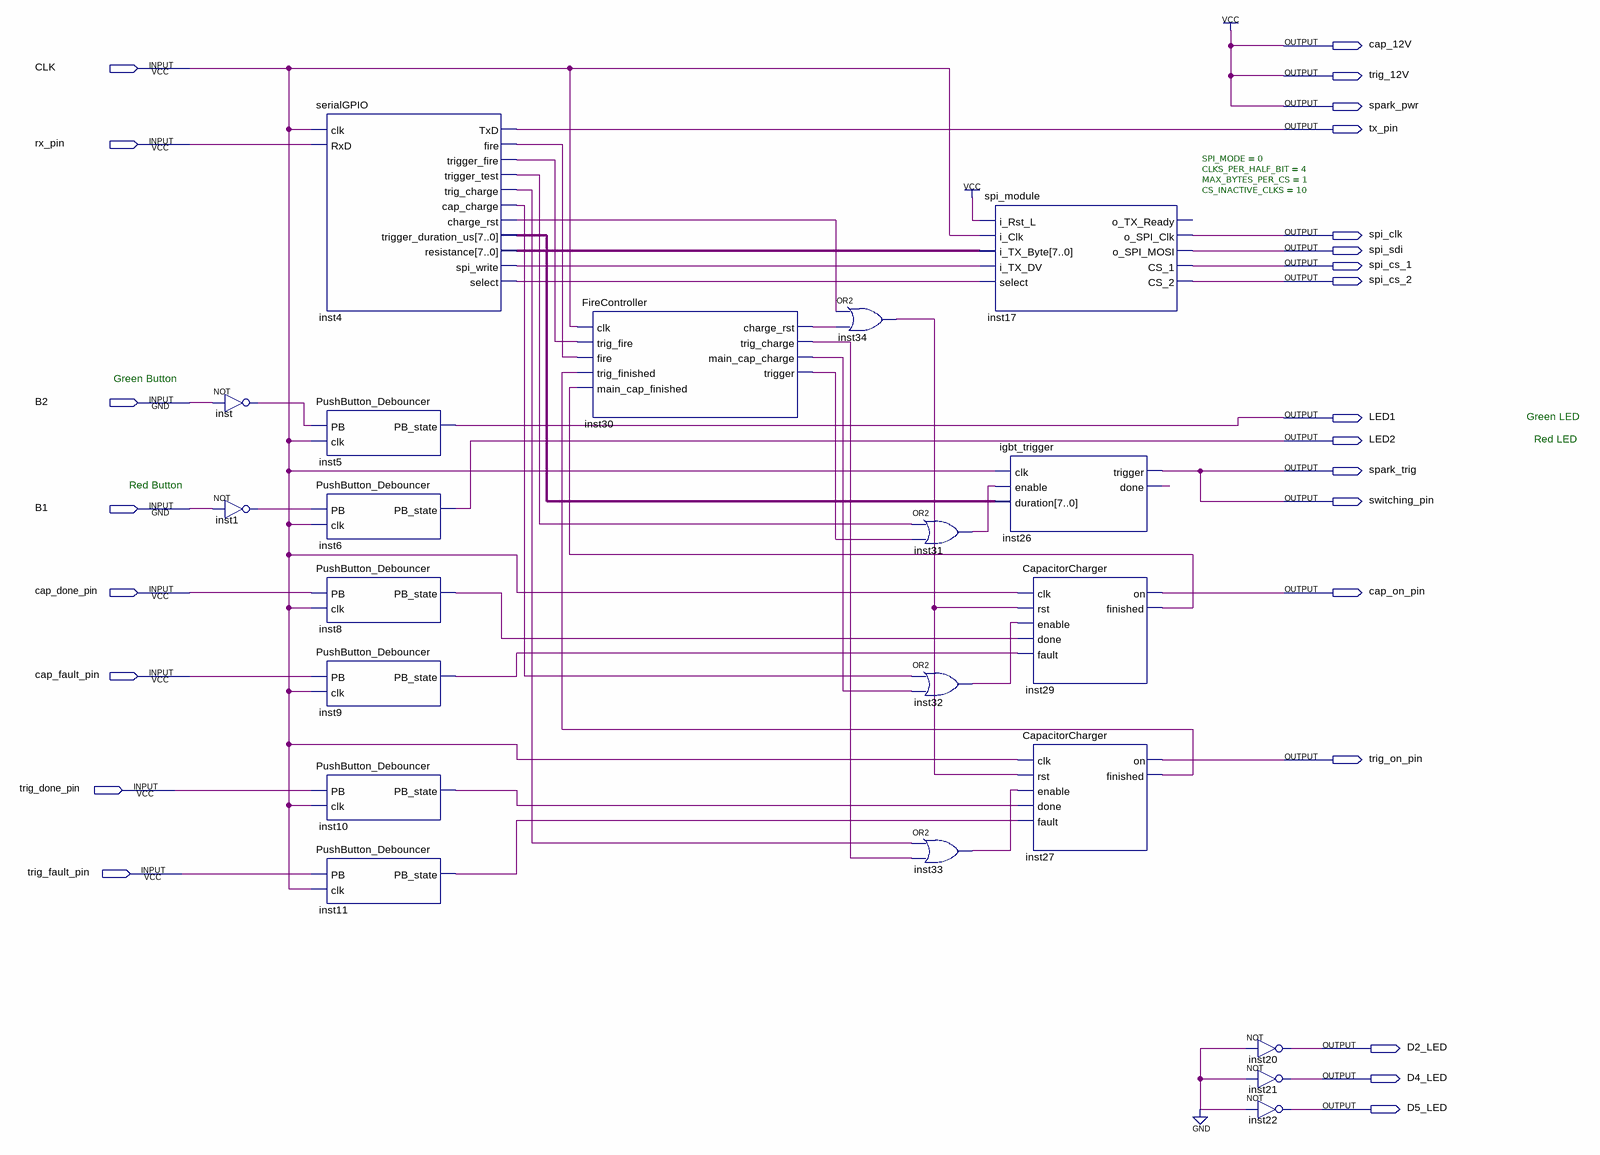
[diagram p0: schematic sheet]
// Quartus schematic PPT_FPGA_CYC_4.bdf as structural Verilog: 21 symbols, 25 pins
module PPT_FPGA_CYC_4 (
  input  CLK,
  input  rx_pin,
  input  B2,
  input  B1,
  input  cap_done_pin,
  input  cap_fault_pin,
  input  trig_done_pin,
  input  trig_fault_pin,
  output cap_12V,
  output trig_12V,
  output spark_pwr,
  output tx_pin,
  output spi_clk,
  output spi_sdi,
  output spi_cs_1,
  output spi_cs_2,
  output LED1,
  output LED2,
  output spark_trig,
  output switching_pin,
  output cap_on_pin,
  output trig_on_pin,
  output D2_LED,
  output D4_LED,
  output D5_LED
);

  wire inst1_out, inst4_cap_charge, inst4_charge_rst, inst4_fire, inst4_select, inst4_spi_write,
       inst4_trig_charge, inst4_trigger_fire, inst4_trigger_test, inst8_pb_state, inst9_pb_state,
       inst10_pb_state, inst11_pb_state, inst26_done, inst27_finished, inst29_finished, inst30_charge_rst,
       inst30_main_cap_charge, inst30_trig_charge, inst30_trigger, inst31_out, inst32_out, inst33_out,
       inst34_out, inst_out;
  wire [7:0] inst4_resistance, inst4_trigger_duration_us;

  not inst (inst_out, B2);
  not inst1 (inst1_out, B1);
  serialGPIO inst4 (
    .clk(CLK), .RxD(rx_pin), .TxD(tx_pin), .fire(inst4_fire), .trigger_fire(inst4_trigger_fire),
    .trigger_test(inst4_trigger_test), .trig_charge(inst4_trig_charge), .cap_charge(inst4_cap_charge),
    .charge_rst(inst4_charge_rst), .trigger_duration_us(inst4_trigger_duration_us),
    .resistance(inst4_resistance), .spi_write(inst4_spi_write), .select(inst4_select));
  PushButton_Debouncer inst5 (.PB(inst_out), .clk(CLK), .PB_state(LED1));
  PushButton_Debouncer inst6 (.PB(inst1_out), .clk(CLK), .PB_state(LED2));
  PushButton_Debouncer inst8 (.PB(cap_done_pin), .clk(CLK), .PB_state(inst8_pb_state));
  PushButton_Debouncer inst9 (.PB(cap_fault_pin), .clk(CLK), .PB_state(inst9_pb_state));
  PushButton_Debouncer inst10 (.PB(trig_done_pin), .clk(CLK), .PB_state(inst10_pb_state));
  PushButton_Debouncer inst11 (.PB(trig_fault_pin), .clk(CLK), .PB_state(inst11_pb_state));
  FireController inst30 (
    .clk(CLK), .trig_fire(inst4_trigger_fire), .fire(inst4_fire), .trig_finished(inst27_finished),
    .main_cap_finished(inst29_finished), .charge_rst(inst30_charge_rst), .trig_charge(inst30_trig_charge),
    .main_cap_charge(inst30_main_cap_charge), .trigger(inst30_trigger));
  or inst34 (inst34_out, inst4_charge_rst, inst30_charge_rst);
  or inst31 (inst31_out, inst4_trigger_test, inst30_trigger);
  or inst32 (inst32_out, inst4_cap_charge, inst30_main_cap_charge);
  or inst33 (inst33_out, inst4_trig_charge, inst30_trig_charge);
  spi_module #(.SPI_MODE(0), .CLKS_PER_HALF_BIT(4), .MAX_BYTES_PER_CS(1), .CS_INACTIVE_CLKS(10)) inst17 (
    .i_Rst_L(1'b1), .i_Clk(CLK), .i_TX_Byte(inst4_resistance), .i_TX_DV(inst4_spi_write),
    .select(inst4_select), .o_SPI_Clk(spi_clk), .o_SPI_MOSI(spi_sdi), .CS_1(spi_cs_1), .CS_2(spi_cs_2));  // open: o_TX_Ready
  igbt_trigger inst26 (
    .clk(CLK), .enable(inst31_out), .duration(inst4_trigger_duration_us), .trigger(spark_trig),
    .done(inst26_done));
  CapacitorCharger inst29 (
    .clk(CLK), .rst(inst34_out), .enable(inst32_out), .done(inst8_pb_state), .fault(inst9_pb_state),
    .on(cap_on_pin), .finished(inst29_finished));
  CapacitorCharger inst27 (
    .clk(CLK), .rst(inst34_out), .enable(inst33_out), .done(inst10_pb_state), .fault(inst11_pb_state),
    .on(trig_on_pin), .finished(inst27_finished));
  not inst20 (D2_LED, 1'b0);
  not inst21 (D4_LED, 1'b0);
  not inst22 (D5_LED, 1'b0);

  assign cap_12V = 1'b1;
  assign spark_pwr = 1'b1;
  assign switching_pin = spark_trig;
  assign trig_12V = 1'b1;

  // Notes on the sheet:
  //   Green Button
  //   Green LED
  //   Red LED
  //   Red Button
endmodule
